# EasyEDA Pro project 3020包裹款控制板V1.1.eprj, board PCB
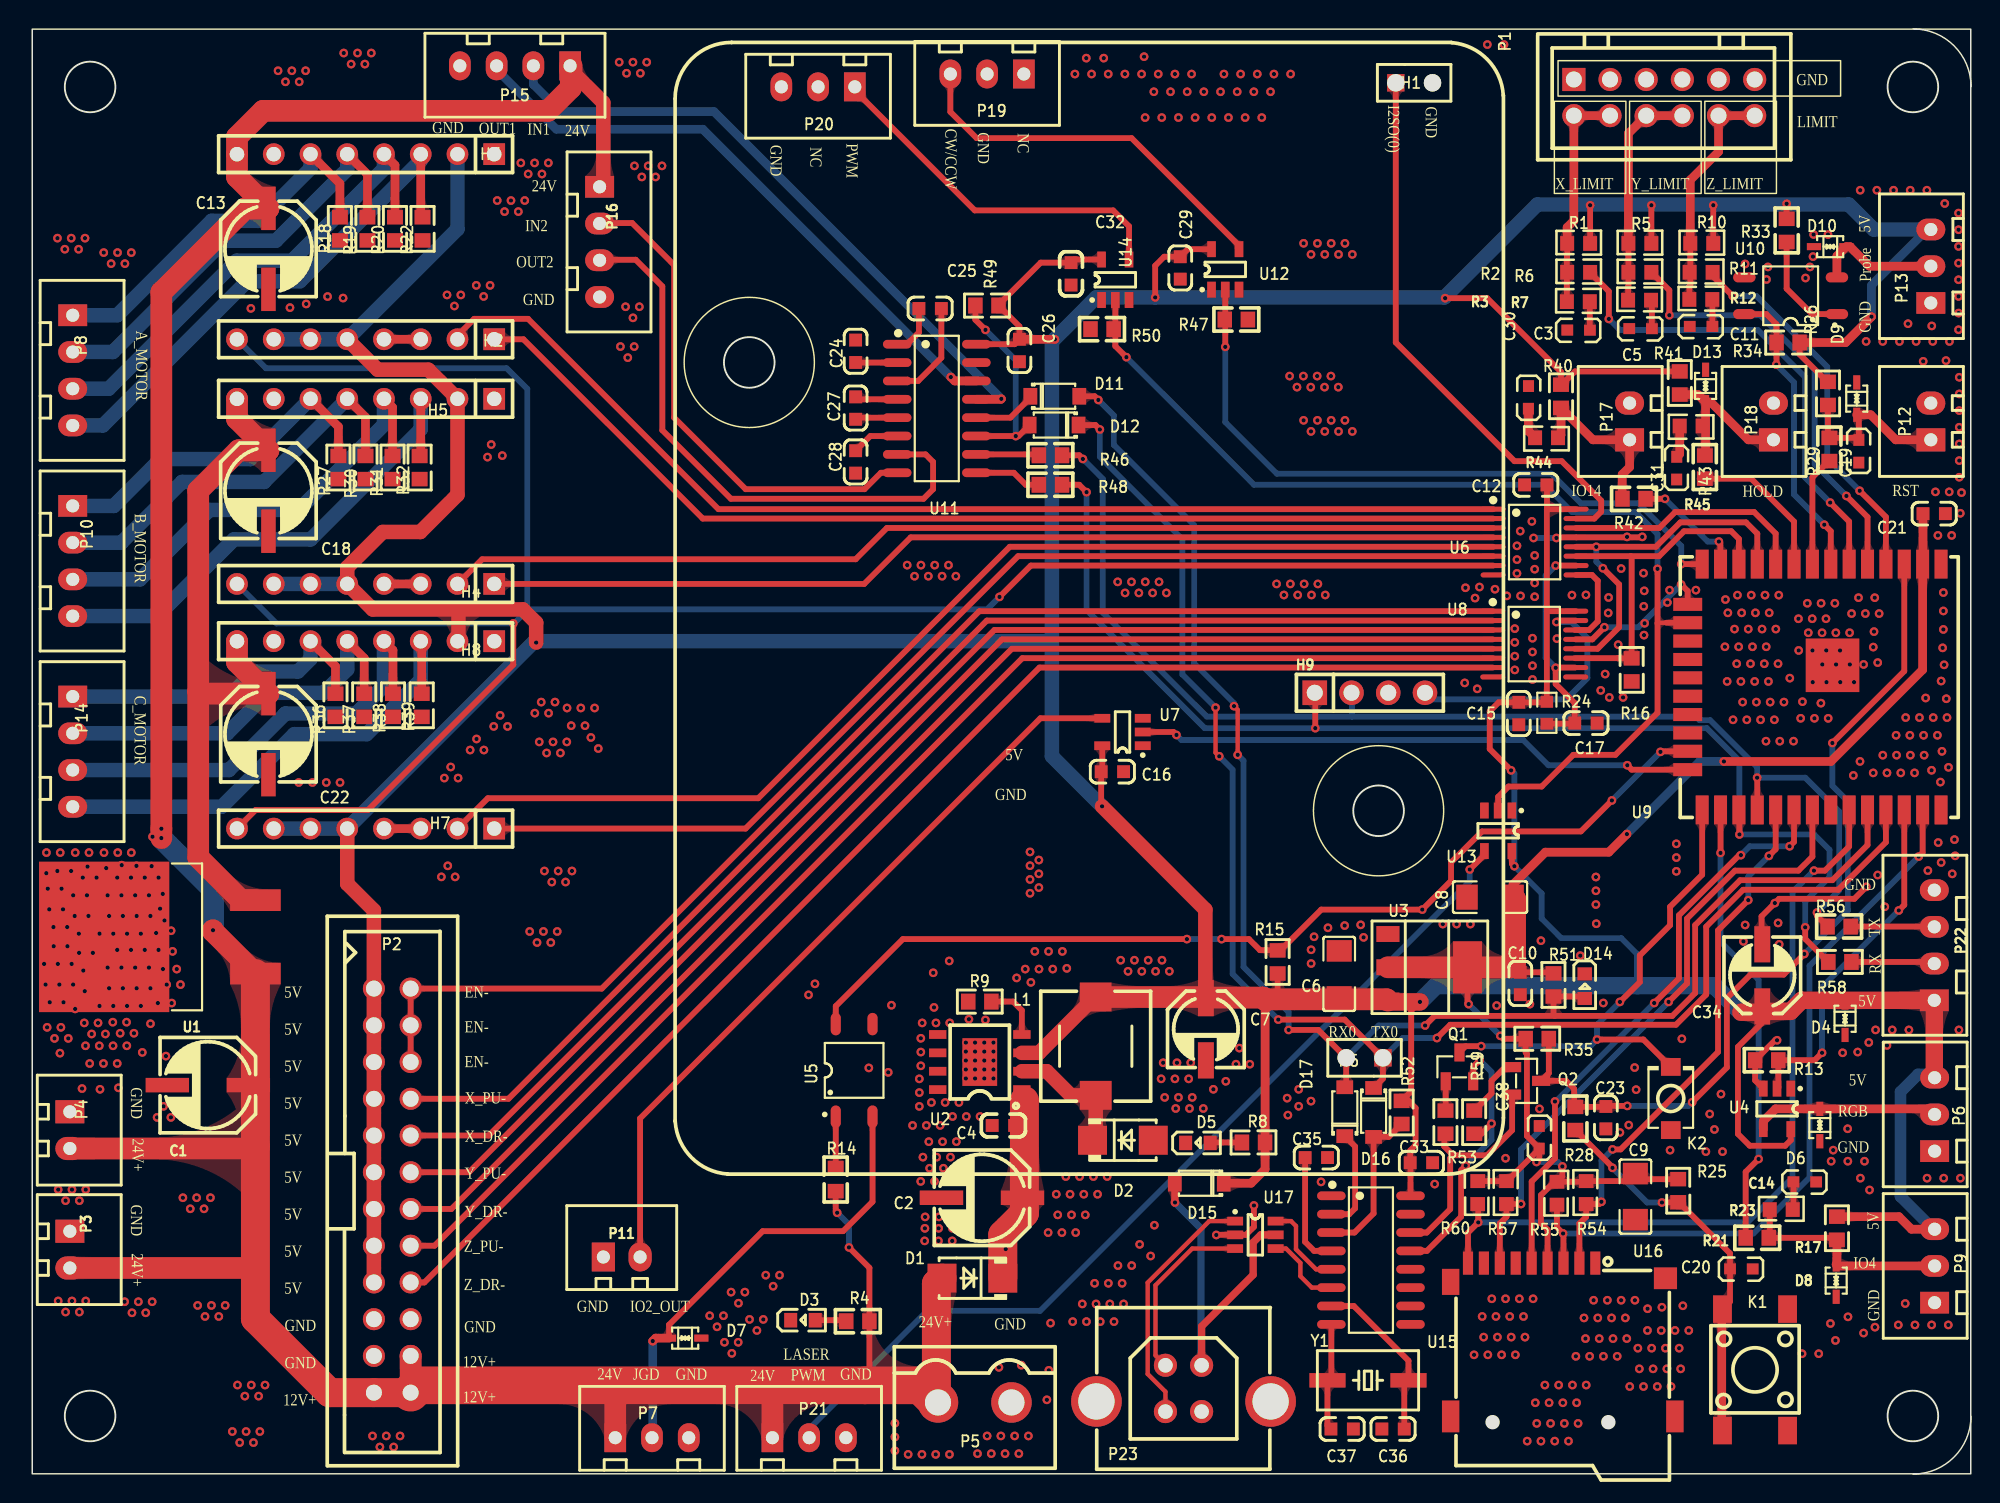
[diagram p1: board, top side]
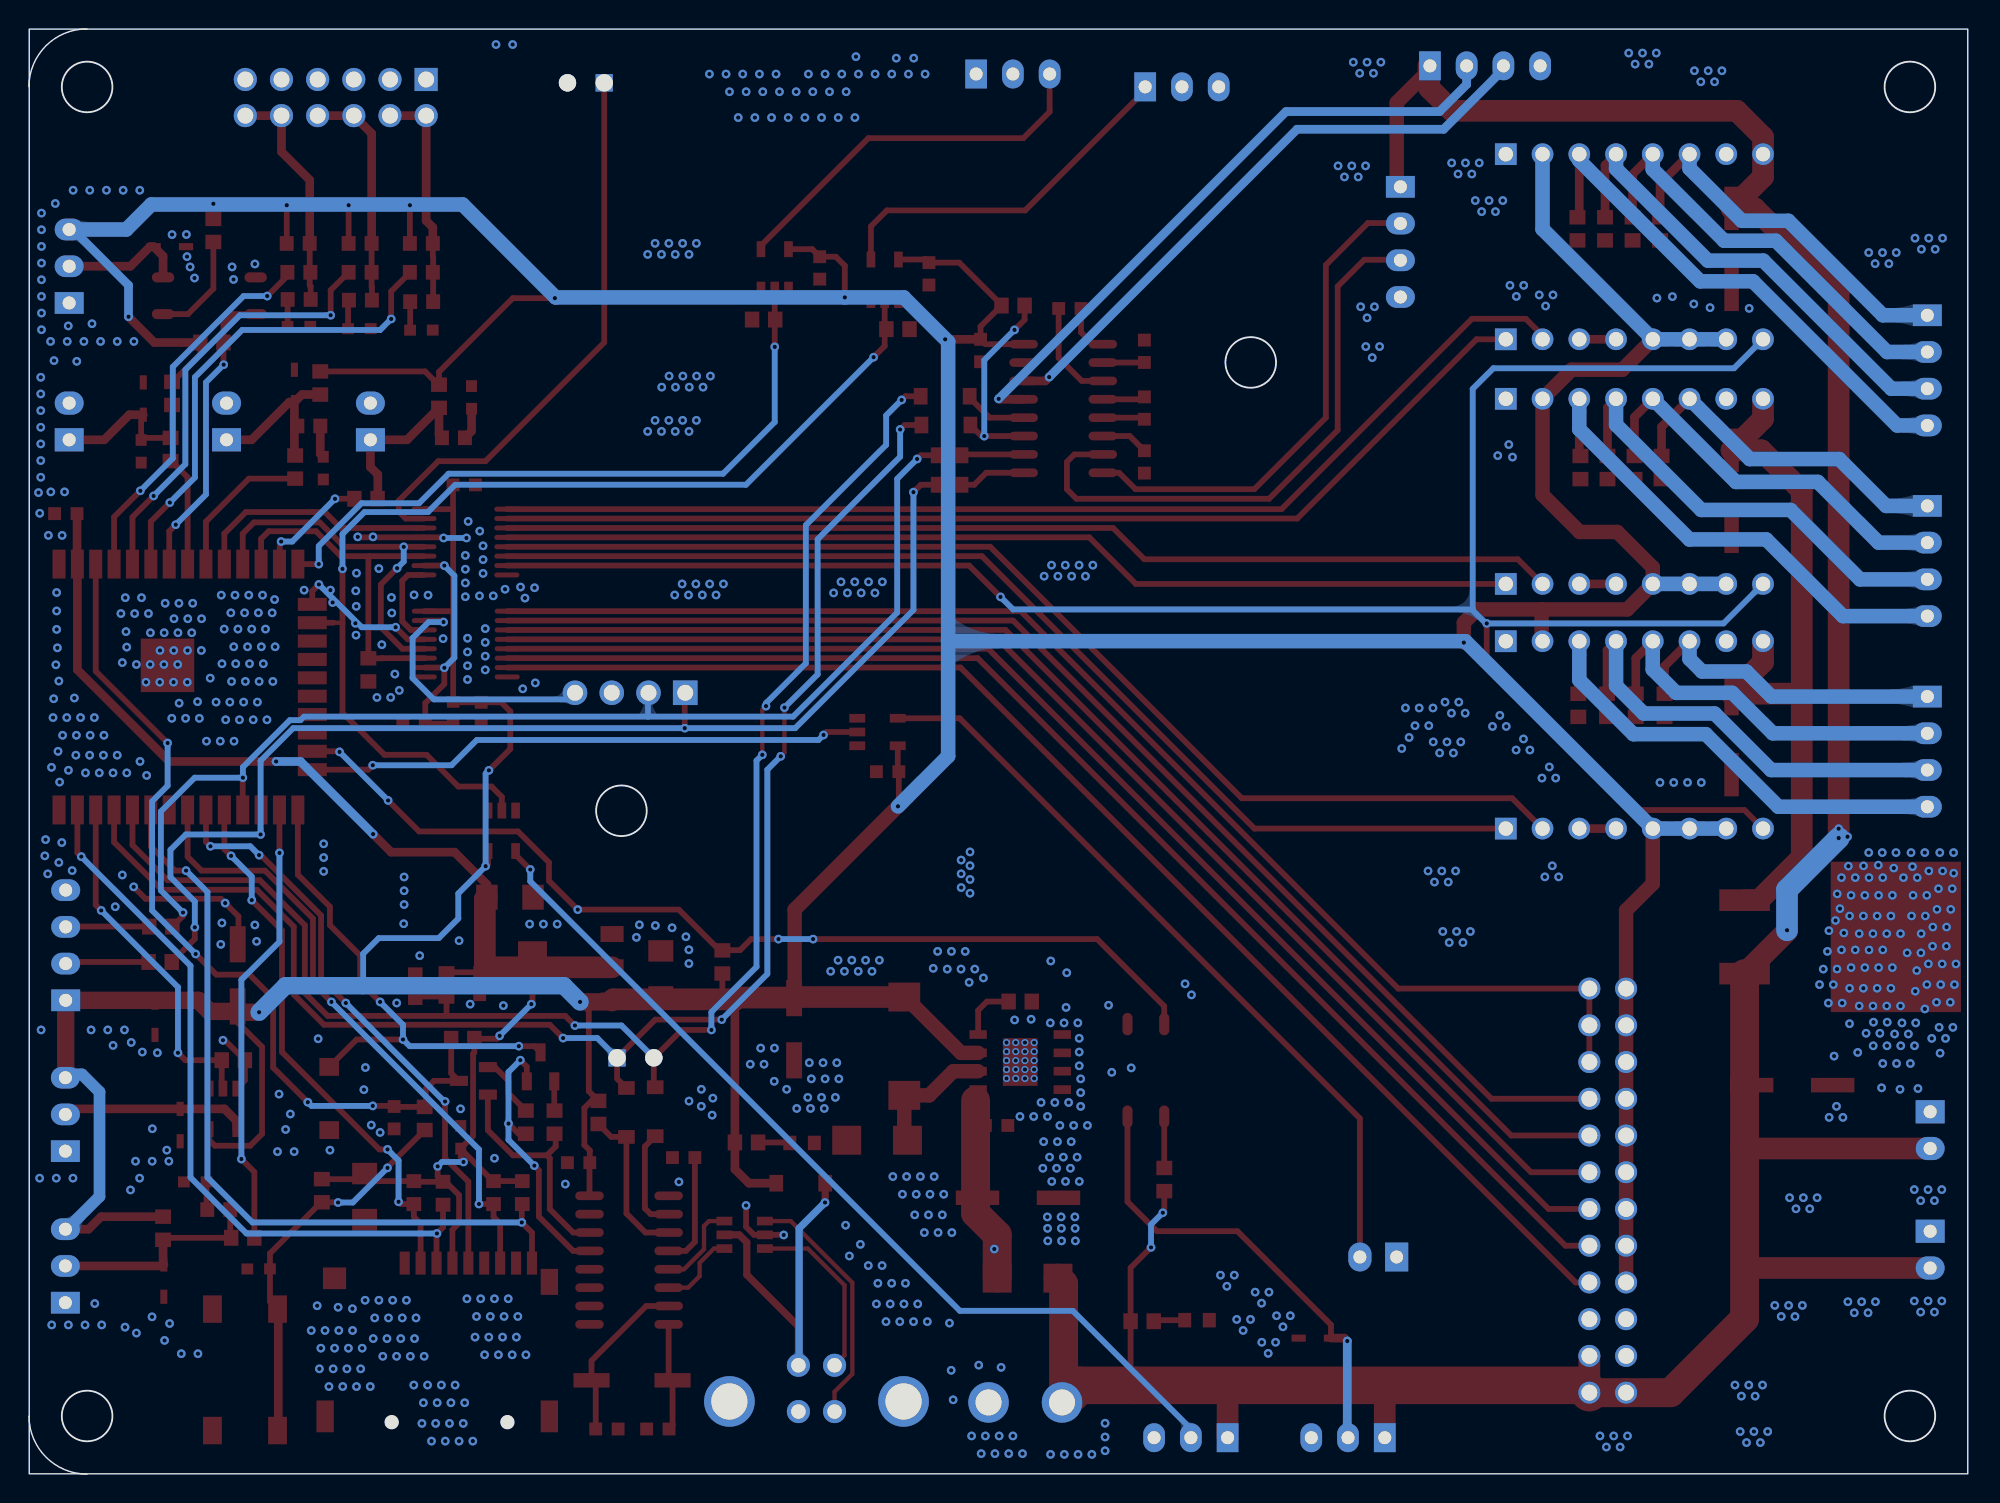
[diagram p2: board, bottom side, seen from below]

Outline 134.02 x 99.93 mm; copper layers: Top Layer, Bottom Layer. Coordinates in mm from the lower left corner of the outline.
Outline path: rectangle 0,99.92 134,0.02 ; circle c4,95.92 r1.75 ; circle c4,4.02 r1.75 ; circle c49.56,76.87 r1.75 ; circle c93.06,45.87 r1.75 ; circle c130,95.92 r1.75 ; circle c130,4.02 r1.75 ; 130.02,99.93 arc(132.85,98.76) 134.02,95.93 ; 134.01,4 arc(132.84,1.17) 130.01,0
Stack: Top Layer 0.035mm / Dielectric1 1.51mm FR4 er 4.5 / Bottom Layer 0.035mm

## Design rules (mm)
template: 用户自定义配置
spacing Default (default): track to track 0.152, other pairs 0 to 0.152
track width Default (default): min 0.254, default 0.254, max 25.4
differential pair differentialPair (default): width min 0.127, default 0.254, max 2.54; gap min 0.152, default 0.152
via Default (default): diameter min 0.25, default 0.61, max 100.025; hole min 0.2, default 0.305, max 59.995

## Placement (name value [footprint] x y rotation side)
C1  100uF/35V  [电解电容贴片6X6]  12.14 26.89 180 top
C2  100uF/35V  [电解电容贴片6X6]  65.65 19.11 180 top
C3  103  [11]  107.63 78.8 0 top
C4  104  [0603C]  67.13 24.1 0 top
C5  103  [11]  111.92 78.9 0 top
C6  10uF  [C1206]  90.34 34.58 90 top
C7  100uF/10V  [CAP-SMD_BD5.0-L5.3-W5.3-RD]  81.13 30.76 90 top
C8  4.7uF  [C1206]  100.77 39.89 0 top
C9  4.7uF  [C1206]  110.82 19.19 90 top
C10  104  [0603C]  102.86 33.92 90 top
C11  103  [11]  116.1 79.06 0 top
C12  104  [0603C]  103.93 68.4 180 top
C13  100uF/35V  [电解电容贴片6X6]  16.33 84.72 270 top
C14  103  [11]  123.27 19.91 0 top
C15  104  [0603C]  102.76 52.59 270 top
C16  104  [0603C]  74.66 48.57 180 top
C17  104  [0603C]  107.4 51.93 180 top
C18  100uF/35V  [电解电容贴片6X6]  16.33 67.99 270 top
C19  103  [11]  125.96 69.98 270 top
C20  103  [11]  118.88 13.89 0 top
C21  104  [0603C]  131.47 66.41 0 top
C22  100uF/35V(47uF/50V)  [电解电容贴片6X6]  16.33 51.16 270 top
C23  104  [0603C]  108.78 24.64 90 top
C24  104  [0603C]  56.92 77.64 270 top
C25  104  [0603C]  62.07 80.6 180 top
C26  104  [0603C]  68.24 77.69 90 top
C27  104  [0603C]  56.92 73.71 90 top
C28  104  [0603C]  56.92 69.99 270 top
C29  104  [0603C]  79.36 83.4 90 top
C30  103  [11]  103.72 75.19 90 top
C31  103  [11]  113.37 68.82 270 top
C32  104  [0603C]  71.81 82.99 90 top
C33  104  [0603C]  96.03 21.53 0 top
C34  100uF/10V  [CAP-SMD_BD5.0-L5.3-W5.3-RD]  119.59 34.49 270 top
C35  104  [0603C]  88.76 21.89 0 top
C36  18pF  [0603C]  94.07 3.12 180 top
C37  18pF  [0603C]  90.55 3.12 0 top
C38  104  [11]  104.47 24.03 90 top
D1  SS56  [SMA]  64.99 13.55 180 top
D2  SS34  [SMA]  75.39 23.08 0 top
D3  绿光  [0603LED]  53.24 10.62 180 top
D4  PESD5V0L1BA-N  [SOD-323_L1.8-W1.3-LS2.5-BI]  125.31 31.48 90 top
D5  绿光  [0603LED]  80.54 22.88 180 top
D6  PESD5V0L1BA-N  [SOD-323_L1.8-W1.3-LS2.5-BI]  123.57 24.13 90 top
D7  PESD5V0L1BA-N  [SOD-323_L1.8-W1.3-LS2.5-BI]  45.14 9.4 180 top
D8  PESD5V0L1BA-N  [SOD-323_L1.8-W1.3-LS2.5-BI]  124.7 13.38 90 top
D9  PESD5V0L1BA-N  [SOD-323_L1.8-W1.3-LS2.5-BI]  126.12 74.37 270 top
D10  PESD5V0L1BA-N  [SOD-323_L1.8-W1.3-LS2.5-BI]  124.28 84.87 0 top
D11  1N4148  [SOD-123_L2.8-W1.8-LS3.7-RD]  70.69 74.53 0 top
D12  1N4148  [SOD-123_L2.8-W1.8-LS3.7-RD]  70.64 72.54 180 top
D13  PESD5V0L1BA-N  [SOD-323_L1.8-W1.3-LS2.5-BI]  115.67 75.24 270 top
D14  绿光  [0603LED]  107.3 33.77 90 top
D15  1N4148  [SOD-123_L2.8-W1.8-LS3.7-RD]  80.67 20.11 180 top
D16  1N4148  [SOD-123_L2.8-W1.8-LS3.7-RD]  92.72 25.01 270 top
D17  1N4148  [SOD-123_L2.8-W1.8-LS3.7-RD]  90.73 25.06 90 top
H1  PZ254  [HDR-TH_2P-P2.54-V-M]  95.52 96.2 0 top
H2  PZ254V-11-08P  [HDR-TH_8P-P2.54-V-M]  23.04 78.47 180 top
H3  PZ254V-11-08P  [HDR-TH_8P-P2.54-V-M]  23.04 91.27 180 top
H4  PZ254V-11-08P  [HDR-TH_8P-P2.54-V-M]  23.04 61.55 180 top
H5  PZ254V-11-08P  [HDR-TH_8P-P2.54-V-M]  23.04 74.35 180 top
H6  PZ254V-11-02P  [HDR-TH_2P-P2.54-V-M]  92.1 28.78 180 top
H7  PZ254V-11-08P  [HDR-TH_8P-P2.54-V-M]  23.04 44.64 180 top
H8  PZ254V-11-08P  [HDR-TH_8P-P2.54-V-M]  23.04 57.59 180 top
H9  PZ254V-11-04P  [HDR-TH_4P-P2.54-V-M]  92.46 54.03 0 top
K1  SW_6X6_H=12.0MM  [KEY-SMD_4P-L6.0-W6.0-P4.50-LS9.0]  119.09 7.21 270 top
K2  TS-1088  [SW-SMD_L3.9-W3.0-P4.45]  113.26 25.97 90 top
L1  68uH  [IND-SMD_L7.0-W7.0_SMDRI74-330MT]  73.51 29.59 270 top
P1  XHD2.54-2x6A  [CONN-TH_12P-P2.50_HC-XHD2.54-2X6A]  112.81 95.18 180 top
P2  XHD2.54-2*12  [IDC-TH_24P-P2.54-V-R2-C12-S2.54]  24.89 19.6 270 top
P3  2P  [HDR1X2_CON]  2.6 15.52 270 top
P4  2P  [HDR1X2_CON]  2.6 23.78 270 top
P5  KF2EDGVC-5.08-2P  [CONN-TH_P5.08_KF2EDGVC-5.08-2P]  65.15 4.95 0 top
P6  3P  [HDR1X3_CON]  131.5 24.87 90 top
P7  3P  [HDR1X3_CON]  42.84 2.52 0 top
P8  4P  [HDR1X4_CON]  2.8 80.13 270 top
P9  3P  [HDR1X3_CON]  131.5 14.39 90 top
P10  4P  [HDR1X4_CON]  2.8 66.95 270 top
P11  2P  [HDR1X2_CON]  40.75 15.01 0 top
P12  2P  [HDR1X2_CON]  131.24 72.79 90 top
P13  3P  [HDR1X3_CON]  131.24 83.52 90 top
P14  4P  [HDR1X4_CON]  2.8 53.76 270 top
P15  4P  [HDR1X4_CON]  37.18 97.38 180 top
P16  4P  [HDR1X4_CON]  39.22 89.01 270 top
P17  2P  [HDR1X2_CON]  110.42 72.79 90 top
P18  2P  [HDR1X2_CON]  120.36 72.79 90 top
P19  3P  [HDR1X3_CON]  66 96.81 180 top
P20  3P  [HDR1X3_CON]  54.32 95.92 180 top
P21  3P  [HDR1X3_CON]  53.7 2.52 0 top
P22  4P  [HDR1X4_CON]  131.48 32.76 90 top
P23  USB-B12-BRW  [USB-B-TH_USB-B12-BRW]  79.58 5.92 0 top
Q1  SS8050  [SOT-23-3_L2.9-W1.3-P1.90-LS2.4-BR]  98.66 28.16 270 top
Q2  SS8050  [SOT-23-3_L2.9-W1.3-P1.90-LS2.4-BR]  103.3 27.19 180 top
R1  51K  [10]  106 84.98 0 top
R2  100  [10]  106 82.98 0 top
R3  100  [10]  105.98 80.95 0 top
R4  47K  [0603R]  57.07 10.57 0 top
R5  51K  [10]  110.23 84.98 0 top
R6  100  [10]  110.23 82.98 0 top
R7  100  [10]  110.21 81.06 0 top
R8  10K  [0603R]  84.42 22.93 0 top
R9  10K  [0603R]  65.5 32.67 180 top
R10  51K  [10]  114.51 84.98 0 top
R11  100  [10]  114.47 82.98 0 top
R12  100  [10]  114.45 81.11 0 top
R13  10K  [0603R]  119.9 28.62 180 top
R14  22K  [0603R]  55.54 20.37 90 top
R15  10K  [0603R]  86.09 35.41 90 top
R16  10K  [0603R]  110.56 55.61 270 top
R17  10K  [0603R]  124.75 17 270 top
R18  10K  [0603R]  21.27 86.11 270 top
R19  10K  [0603R]  23.17 86.11 270 top
R20  10K  [0603R]  25.08 86.11 270 top
R21  100  [0603R]  119.24 16.34 0 top
R22  10K  [0603R]  26.98 86.11 270 top
R23  100  [10]  120 18.17 0 top
R24  10kΩ  [R0603]  104.7 52.64 90 top
R25  10K  [0603R]  113.77 19.59 270 top
R26  10K  [0603R]  124.13 74.73 270 top
R27  10K  [0603R]  21.17 69.6 270 top
R28  100  [0603R]  106.66 24.59 270 top
R29  100  [0603R]  124.23 70.85 90 top
R30  10K  [0603R]  23.04 69.6 270 top
R31  10K  [0603R]  24.91 69.6 270 top
R32  10K  [0603R]  26.78 69.6 270 top
R33  1K  [0603R]  121.27 86 270 top
R34  10K  [0603R]  121.37 78.24 180 top
R35  10K  [0603R]  104.03 30.1 0 top
R36  10K  [0603R]  20.96 53.16 270 top
R37  10K  [0603R]  22.95 53.16 270 top
R38  10K  [0603R]  24.94 53.16 270 top
R39  10K  [0603R]  26.92 53.16 270 top
R40  10K  [0603R]  105.67 74.53 270 top
R41  10K  [0603R]  113.88 75.45 270 top
R42  100  [0603R]  110.72 67.44 180 top
R43  100  [0603R]  115.62 69.63 90 top
R44  100  [10]  105.57 71.77 180 top
R45  100  [10]  115.57 72.59 180 top
R46  0Ω  [0603R]  70.38 70.45 0 top
R47  100  [0603R]  83.23 79.83 0 top
R48  0Ω  [0603R]  70.38 68.41 0 top
R49  10K  [0603R]  66 80.8 180 top
R50  10K  [0603R]  73.95 79.17 180 top
R51  10K  [0603R]  105.16 33.82 90 top
R52  10K  [0603R]  94.66 25.01 270 top
R53  10K  [0603R]  97.69 24.33 90 top
R54  10K  [10]  107.53 18.57 90 top
R55  10K  [10]  105.51 18.52 90 top
R56  100Ω  [0603R]  124.9 37.86 0 top
R57  10K  [10]  102.02 18.57 90 top
R58  100Ω  [0603R]  124.95 35.41 0 top
R59  10K  [0603R]  99.68 24.33 90 top
R60  10K  [10]  100.03 18.57 90 top
U1  CJ7812  [TO-263-2_L10.1-W9.1-P5.08-LS15.2-TL]  10.2 37.15 180 top
U2  XL1509-5.0E1//SXL1509-5.0E1  [ESOP-8_L4.9-W3.9-P1.27-LS6.0-BL-EP]  65.5 28.49 90 top
U3  1117-3.3  [SOT-223]  96.41 35.04 270 top
U4  74LVC1G17  [SOT-23-5]  120.61 25.25 270 top
U5  LTV-357T-C  [SOP-4_L4.4-W3.9-P2.54-LS7.0-TL]  56.81 27.91 90 top
U6  74AHCT595T16-13  [TSSOP-16_L5.0-W4.4-P0.65-LS6.4-BL]  103.85 64.45 270 top
U7  74LVC1G17  [SOT-23-5]  75.37 51.31 180 top
U8  74AHCT595T16-13  [TSSOP-16_L5.0-W4.4-P0.65-LS6.4-BL]  103.83 57.39 270 top
U9  ESP32-WROOM-32  [WIFI-SMD_ESP32-WROOM-32UE-A]  123.19 54.42 270 top
U10  LTV-357T-C  [SOP-4_L4.4-W3.9-P2.54-LS7.0-TL]  121.55 81.48 180 top
U11  SP3232EEN-L/TR  [SOIC-16_L9.9-W3.9-P1.27-LS6.0-BL]  62.53 73.68 270 top
U12  74LVC1G17  [SOT-23-5]  82.47 83.3 90 top
U13  74LVC1G17  [SOT-23-5]  101.33 44.48 270 top
U14  74LVC1G17  [SOT-23-5]  74.87 82.58 90 top
U15  CH340G  [SOIC-16_L9.9-W3.9-P1.27-LS6.0-BL]  92.54 14.8 270 top
U16  自弹TF卡座TFAA  [SIM-SMD_C9900015645]  105.8 9.29 0 top
U17  USBLC2-2SC6  [SOT-23-6]  84.55 16.54 0 top
Y1  12M  [晶振贴片49SSMD]  92.33 6.48 0 top

## Footprints (pads in the part's own frame, mm; a bottom-side part is the same pattern mirrored in y, then rotated)
10
  rect 0.965x1.016 smd: 1(0.101,0.117) 2(1.688,0.117)
11
  rect 0.813x0.762 smd: 1(0.043,0.296) 2(-1.524,0.301)
0603C
  rect 0.889x0.889 smd: 1(-0.774,0) 2(0.774,0)
0603LED
  rect 0.9x1 smd: 1(-0.884,-0.017) 2(0.816,-0.017)
0603R
  rect 1x1.1 smd: 1(-0.8,0) 2(0.8,0)
C1206
  rect 1.485x1.728 smd: 1(-1.593,0) 2(1.593,0)
CAP-SMD_BD5.0-L5.3-W5.3-RD
  rect 2.5x1.1 smd: 1(2.15,0) 2(-2.15,0)
CONN-TH_12P-P2.50_HC-XHD2.54-2X6A
  rect 1.6x1.6 hole 1.1: 1(6.25,-1.25)
  round 1.6 hole 1.1: 2(6.25,1.25) 3(3.75,-1.25) 4(3.75,1.25) 5(1.25,-1.25) 6(1.25,1.25) 7(-1.25,-1.25) 8(-1.25,1.25) 9(-3.75,-1.25) 10(-3.75,1.25) 11(-6.25,-1.25) 12(-6.25,1.25)
CONN-TH_P5.08_KF2EDGVC-5.08-2P
  round 2.8 hole 1.8: 1(-2.54,0) 2(2.54,0)
ESOP-8_L4.9-W3.9-P1.27-LS6.0-BL-EP
  rect 0.6x1.2 smd: 1(-1.905,-2.909) 2(-0.635,-2.909) 3(0.635,-2.909) 4(1.905,-2.909) 5(1.905,2.909) 6(0.635,2.909) 7(-0.635,2.909) 8(-1.905,2.909)
  rect 3.3x2.4 smd: 9(0,0)
HDR1X2_CON
  rect 1.6x2 hole 0.9: 1(-1.27,0)
  oval 1.6x2 hole 0.9: 2(1.27,0)
HDR1X3_CON
  rect 1.5x2 hole 0.9: 1(-2.54,0)
  oval 1.5x2 hole 0.9: 2(0,0) 3(2.54,0)
HDR1X4_CON
  rect 1.5x2 hole 0.9: 1(0,0)
  oval 1.5x2 hole 0.9: 2(2.54,0) 3(5.08,0) 4(7.62,0)
HDR-TH_2P-P2.54-V-M
  rect 1.2x1.2 hole 1.2x0.8: 1(-1.27,0)
  round 1.2 hole 1.2x0.8: 2(1.27,0)
HDR-TH_4P-P2.54-V-M
  rect 1.7x1.7 hole 1.1: 1(-3.81,0)
  round 1.7 hole 1.1: 2(-1.27,0) 3(1.27,0) 4(3.81,0)
HDR-TH_8P-P2.54-V-M
  rect 1.5x1.5 hole 1: 1(-8.89,0)
  round 1.5 hole 1: 2(-6.35,0) 3(-3.81,0) 4(-1.27,0) 5(1.27,0) 6(3.81,0) 7(6.35,0) 8(8.89,0)
IDC-TH_24P-P2.54-V-R2-C12-S2.54
  round 1.524 hole 1.1: 1(-13.97,-1.27) 2(-13.97,1.27) 3(-11.43,-1.27) 4(-11.43,1.27) 5(-8.89,-1.27) 6(-8.89,1.27) 7(-6.35,-1.27) 8(-6.35,1.27) 9(-3.81,-1.27) 10(-3.81,1.27) 11(-1.27,-1.27) 12(-1.27,1.27) 13(1.27,-1.27) 14(1.27,1.27) 15(3.81,-1.27) 16(3.81,1.27) 17(6.35,-1.27) 18(6.35,1.27) 19(8.89,-1.27) 20(8.89,1.27) 21(11.43,-1.27) 22(11.43,1.27) 23(13.97,-1.27) 24(13.97,1.27)
IND-SMD_L7.0-W7.0_SMDRI74-330MT
  rect 2x2.2 smd: 1(-3.4,0) 2(3.4,0)
KEY-SMD_4P-L6.0-W6.0-P4.50-LS9.0
  rect 1.9x1.3 smd: 1(-4.2,2.25) 2(4.2,2.25) 3(-4.2,-2.25) 4(4.2,-2.25)
R0603
  rect 0.806x0.864 smd: 1(-0.753,0) 2(0.753,0)
SIM-SMD_C9900015645
  rect 0.7x1.6 smd: 1(2.25,5.3) 2(1.15,5.3) 3(0.05,5.3) 4(-1.05,5.3) 5(-2.15,5.3) 6(-3.25,5.3) 7(-4.35,5.3) 8(-5.45,5.3) 9(-6.55,5.3)
  rect 1.2x1.8 smd: 10(-7.75,4)
  rect 1.6x1.5 smd: 11(7.1,4.25)
  rect 1.2x2.2 smd: 12(-7.75,-5.3) 13(7.75,-5.3)
SMA
  rect 2x2 smd: 1(2.1,0) 2(-2.1,0)
SOD-123_L2.8-W1.8-LS3.7-RD
  rect 0.95x1.15 smd: 1(-1.692,0) 2(1.692,0)
SOD-323_L1.8-W1.3-LS2.5-BI
  rect 0.986x0.49 smd: 1(-1.117,0) 2(1.117,0)
SOIC-16_L9.9-W3.9-P1.27-LS6.0-BL
  oval 0.602x1.971 smd: 1(-4.445,-2.736) 2(-3.175,-2.736) 3(-1.905,-2.736) 4(-0.635,-2.736) 5(0.635,-2.736) 6(1.905,-2.736) 7(3.175,-2.736) 8(4.445,-2.736) 9(4.445,2.736) 10(3.175,2.736) 11(1.905,2.736) 12(0.635,2.736) 13(-0.635,2.736) 14(-1.905,2.736) 15(-3.175,2.736) 16(-4.445,2.736)
SOP-4_L4.4-W3.9-P2.54-LS7.0-TL
  oval 1.55x0.7 smd: 1(-3.2,1.27) 2(-3.2,-1.27) 3(3.2,-1.27) 4(3.2,1.27)
SOT-23-3_L2.9-W1.3-P1.90-LS2.4-BR
  rect 1.25x0.7 smd: 1(1,-0.95) 2(1,0.95) 3(-1,0)
SOT-23-5
  rect 1.1x0.6 smd: 1(-1.4,0.95) 2(-1.4,0) 3(-1.4,-0.95) 4(1.4,-0.95) 5(1.4,0.95)
SOT-23-6
  rect 1.1x0.6 smd: 1(-1.4,0.95) 2(-1.4,0) 3(-1.4,-0.95) 4(1.4,-0.95) 5(1.4,0) 6(1.4,0.95)
SOT-223
  rect 1.1x1.6 smd: 1(-2.3,-2.7) 2(0,-2.7) 3(2.3,-2.7)
  rect 3.6x2 smd: 4(0,2.8)
SW-SMD_L3.9-W3.0-P4.45
  rect 1.23x1.36 smd: 1(-2.185,0) 2(2.185,0)
TO-263-2_L10.1-W9.1-P5.08-LS15.2-TL
  rect 3.5x1.5 smd: 1(-5.228,2.54) 3(-5.228,-2.54)
  rect 9x10.4 smd: 2(5.228,0)
TSSOP-16_L5.0-W4.4-P0.65-LS6.4-BL
  oval 0.343x1.732 smd: 1(-2.275,-2.866) 2(-1.625,-2.866) 3(-0.975,-2.866) 4(-0.325,-2.866) 5(0.325,-2.866) 6(0.975,-2.866) 7(1.625,-2.866) 8(2.275,-2.866) 9(2.275,2.866) 10(1.625,2.866) 11(0.975,2.866) 12(0.325,2.866) 13(-0.325,2.866) 14(-0.975,2.866) 15(-1.625,2.866) 16(-2.275,2.866)
USB-B-TH_USB-B12-BRW
  round 1.6 hole 1: 1(1.25,1.6) 2(-1.25,1.6) 3(-1.25,-1.6) 4(1.25,-1.6)
  round 3.5 hole 2.5: 5(-6.02,-0.9) 6(6.02,-0.9)
WIFI-SMD_ESP32-WROOM-32UE-A
  rect 2x0.9 smd: 1(-8.5,8.755) 2(-8.5,7.485) 3(-8.5,6.215) 4(-8.5,4.945) 5(-8.5,3.675) 6(-8.5,2.405) 7(-8.5,1.135) 8(-8.5,-0.135) 9(-8.5,-1.405) 10(-8.5,-2.675) 11(-8.5,-3.945) 12(-8.5,-5.215) 13(-8.5,-6.485) 14(-8.5,-7.755) 25(8.5,-7.755) 26(8.5,-6.485) 27(8.5,-5.215) 28(8.5,-3.945) 29(8.5,-2.675) 30(8.5,-1.405) 31(8.5,-0.135) 32(8.5,1.135) 33(8.5,2.405) 34(8.5,3.675) 35(8.5,4.945) 36(8.5,6.215) 37(8.5,7.485) 38(8.5,8.755)
  rect 0.9x2 smd: 15(-5.715,-8.755) 16(-4.445,-8.755) 17(-3.175,-8.755) 18(-1.905,-8.755) 19(-0.635,-8.755) 20(0.635,-8.755) 21(1.905,-8.755) 22(3.175,-8.755) 23(4.445,-8.755) 24(5.715,-8.755)
  rect 3.7x3.7 smd: 39(-1.5,1.255)
晶振贴片49SSMD
  rect 2.5x1 smd: 1(-2.8,0) 2(2.8,0)
电解电容贴片6X6
  rect 3x1 smd: 1(-2.8,0) 2(2.8,0)

## Nets
As in the schematic.

Pads without a net: P19 1; P20 2; U2 9; U4 1; U7 1; U8 9; U9 17 18 19 20 21 22 32; U12 1; U13 1; U14 1; U15 9 10 11 12 15; U16 1 8

## Via types
v1: diameter 0.5, hole 0.3, Top Layer to Bottom Layer, 20 vias
v2: diameter 0.6, hole 0.3, Top Layer to Bottom Layer, 958 vias

## Routing (per net, layer and track width the routed paths; a pad name or vN(x,y) marks a point on that pad's centre or on a via; arc(x,y) is an arc through that point)
3V3: length 101.9
  Top Layer w0.4: v2(99.29,32.5) 99.21,32.57 U3.4 ; U16.4 104.75,16.89 104.29,17.35 104.29,19.29 105.21,20.21 R55.2 ; R55.2 107.37,20.21 R54.2 110.3,20.26 C9.2 111.2,20.39 113.77,20.39 ; R55.2 105.77,20.58 v2(105.77,21.28) ; 102.86,34.7 105.08,34.7 R51.2 ; 104.17,22.48 101.95,20.26 R57.2 R60.2 ; 104.17,22.48 104.17,21.77 v2(103.98,21.58) ; 104.17,22.48 C38.2 104.17,22.53 103.32,23.38 103.32,29.06 103.23,29.15 R35.1 101.69,30.1 v2(101.48,30.3)
  Top Layer w0.6: 130.7,66.41 130.7,62.95 U9.2 130.67,55.62 124.33,49.28 v2(116.94,49.28) ; C8.2 102.36,40.77 104.59,43 108.98,43 v2(110.23,44.25)
  Top Layer w1.5: 102.18,35.03 102.5,35.35 102.5,39.75 C8.2 ; U3.2 U3.4 102.18,35.04
  Bottom Layer w0.4: v2(101.48,30.3) v2(99.29,32.5) ; v2(103.98,21.58) 105.46,21.58 v2(105.77,21.28)
  Bottom Layer w0.6: v2(116.94,49.28) 115.25,49.28 v2(110.23,44.25)
5V_VCC: length 537.9
  Top Layer w0.4: 104.7,59.64 104.7,53.4 104.67,53.37 101.37,53.37 100.75,52.74 100.75,50.14 v2(102.23,48.66) ; 104.7,59.64 104.7,66.72 104.71,66.73 ; 104.7,59.64 104.73,59.67 U8.16 ; R15.1 86.09,32.95 85.97,32.83 ; 111.92,85.1 v2(111.92,87.74) ; v2(102.45,42.03) 102.28,42.21 U13.5 ; R26.1 124.08,75.53 122.17,77.43 R34.1 ; v2(77.62,81.36) 77.62,83.56 78.24,84.18 C29.2 79.88,84.7 U12.5 ; R33.1 v2(121.27,87.84) ; 106.72,66.72 104.71,66.72 104.71,66.73 ; C12.1 104.71,66.73 ; R1.2 v2(107.69,87.74) ; R41.1 106.64,76.25 105.72,75.33 R40.1 105.67,76.21 100.57,81.31 v2(97.67,81.31) ; U7.5 73.97,48.64 C16.2 73.89,46.23 ; 119.54,31.99 119.54,31.17 117.91,29.54 117.91,23.52 118.72,22.7 121.17,22.7 121.56,23.09 U4.5 ; U11.16 67.9,78.13 C26.2 68.24,79.36 R49.1 66.79,80.85 69.71,83.77 C32.2 72.02,83.98 U14.5 ; v2(95.92,32.65) 95.32,32.05 95.32,26.47 R52.1 95.13,25.81 95.63,25.31 95.63,22.75 95.25,22.38 C33.1 95.27,21.51 U15.16 ; R10.2 v2(116.2,87.74)
  Top Layer w0.6: P9.3 129.9,16.93 129.03,17.8 R17.1 ; R34.1 125.35,78.24 v2(127.14,80.03) ; C26.2 v2(70.69,78.47) ; 85.22,32.68 R8.2 85.22,21.08 84.25,20.11 D15.1
  Top Layer w1: H7.5 21.77,40.82 23.62,38.98 P2.1 P2.3 P2.5 P2.7 P2.9 P2.11 P2.13 P2.15 P2.17 ; 29.46,59.79 29.46,57.66 H8.2 ; 29.46,59.79 33.92,59.79 34.83,58.87 v2(34.83,57.49) ; 29.46,59.79 23.54,59.79 H4.5 21.77,62.69 24.23,65.14 26.83,65.14 29.39,67.71 H5.2 27.38,76.36 23.88,76.36 H2.5 ; U2.3 69.59,29.13 73.45,32.99 ; 81.09,33.02 81.09,39.03 v2(73.95,46.17) ; 81.13,32.99 C7.1
  Top Layer w1.2: v2(118.11,31.94) 119.48,31.94 119.54,31.99 121.54,31.99 122.31,32.76 P22.1 131.48,27.43 P6.3 ; 93.81,32.65 v2(95.92,32.65)
  Top Layer w1.5: U3.3 93.63,32.83 85.36,32.83 85.28,32.74 85.07,32.95 81.27,32.95 81.23,32.99 L1.1
  Bottom Layer w0.4: 110.98,33.77 110.92,33.83 110.92,35.98 109.84,37.06 105.69,37.06 104.34,38.41 104.34,40.15 v2(102.45,42.03) 102.45,48.43 v2(102.23,48.66)
  Bottom Layer w0.6: 130.99,86.06 127.14,82.21 v2(127.14,80.03)
  Bottom Layer w0.8: 131.5,17.08 131.25,17.08 129.14,19.19 129.14,26.43 130.35,27.64 131.5,27.64
  Bottom Layer w1: 70.48,57.64 70.44,57.6 34.74,57.6 H7.5 H7.6 H7.7 ; 70.48,57.64 70.48,49.64 v2(73.95,46.17) ; 70.48,57.64 70.48,78.3 73.54,81.36 v2(77.62,81.36) 97.62,81.36 104.04,87.79 125.56,87.79 127.29,86.06 P13.3 ; H3.2 29.39,86.09 H2.5 H2.6 H2.7 ; H4.5 H4.6 H4.7
  Bottom Layer w1.2: v2(118.11,31.94) 116.27,33.77 97.05,33.77 v2(95.92,32.65)
12V: length 232.1
  Top Layer w0.4: R14.1 55.54,18.17 v2(55.64,18.07) ; 57.57,6.14 57.87,6.43 R4.2 57.87,14.26 v2(56.46,15.67)
  Top Layer w1: 37.18,97.13 39.47,94.83 39.47,89.05
  Top Layer w1.5: P7.1 40.3,5.67 40.14,5.83 ; P21.1 51.16,5.67 51.1,5.73 ; P4.2 15.26,22.51 15.43,22.68 ; 15.05,14.14 14.94,14.25 P3.2 ; 37.23,97.08 37.23,95.85 35.65,94.27 15.96,94.27 14.15,92.46 H3.8 14.15,89.7 C13.1 14.73,87.52 8.92,81.72 v2(8.92,44.63) v2(8.92,43.98) ; v2(12.5,37.6) 12.5,37.54 U1.1 ; P2.22 P2.24
  Top Layer w1.6: 37.23,97.08 37.23,97.38
  Top Layer w2: D1.1 62.5,13.16 62.5,5.06 ; P2.24 P2.23 20.55,5.63 15.43,10.75 U1.1
  Top Layer w2.6: P2.24 26.66,6.14 61.43,6.14 62.5,5.06 P5.1
  Bottom Layer w0.4: v2(56.46,15.67) 56.46,17.25 v2(55.64,18.07)
  Bottom Layer w1.5: v2(8.92,43.98) 12.5,40.41 v2(12.5,37.6)
  vias: v2(8.31,44.07)
12V-SW: length 32.3
  Top Layer w0.4: D7.2 44.02,10.32 50.49,16.8 56.05,16.8 58.08,18.83 58.08,24.71
  Top Layer w0.6: v2(42.89,9.2) 43.1,9.4 D7.2
  Bottom Layer w0.6: v2(42.89,9.2) 42.89,2.57 P7.2
12V_DIV: length 50.5
  Top Layer w1.5: 11.47,54.12 11.47,42.64 14.43,39.69 U1.3 ; 11.47,54.12 11.63,53.96 C22.1 14.15,56.14 H8.8 ; 11.47,54.12 11.47,68 14.27,70.79 C18.1 14.15,72.97 H5.8
GND: length 36.6
  Top Layer w0.4: v2(113.98,61.52) 114.43,61.06 U9.15 ; v2(111.29,64.81) 111.26,64.77 105.4,64.77 v2(105.36,64.73) ; v2(120.61,30) 120.47,30 R13.2 119.09,27.22 U4.3 ; v2(81.85,16.53) 81.86,16.54 U17.2 83.9,16.54 84.45,17.09 v2(84.45,18.57) ; U8.13 107.84,57.72 v2(108.67,58.56) ; v2(126.78,40.61) 125.95,39.78 120.75,39.78 v2(120.46,39.48) 119.54,38.57 119.54,36.69 C34.2
  Bottom Layer w0.4: v2(113.98,61.52) 111.02,58.56 v2(108.67,58.56) ; v2(105.36,64.73) v2(103.78,64.73)
  vias: v2(0.82,35.28) v2(0.98,42.97) v2(0.97,41.55) v2(0.92,33.85) v2(1.08,40.48) v2(1.03,30.89) v2(1.18,39.05) v2(1.21,32.62) v2(1.47,37.83) v2(1.48,36.5) v2(1.54,30.13) v2(1.74,85.46) v2(1.74,41.7) v2(1.77,35.28) v2(1.8,19.67) v2(1.8,11.97) v2(1.87,33.85) v2(1.91,29.11) v2(1.94,42.97) v2(1.98,30.89) v2(2.03,40.48) v2(2.13,39.05) v2(2.16,32.62) v2(2.25,84.7) v2(2.3,18.91) v2(2.3,11.2) v2(2.42,37.83) v2(2.44,36.5) v2(2.49,30.13) v2(2.7,85.46) v2(2.69,41.7) v2(2.72,35.28) v2(2.75,19.67) v2(2.75,11.97) v2(2.83,40.02) v2(2.83,33.85) v2(2.97,42.97) v2(2.93,38.59) v2(2.97,32.17) v2(3.21,84.7) v2(3.22,37.37) v2(3.24,36.04) v2(3.26,18.91) v2(3.26,11.2) v2(3.5,41.24) v2(3.44,26.66) v2(3.53,34.82) v2(3.6,31.2) v2(3.65,85.46) v2(3.63,33.39) v2(3.68,29.62) v2(3.7,19.67) v2(3.7,11.97) v2(3.78,40.02) v2(3.82,42) v2(3.89,38.59) v2(3.92,42.97) v2(3.97,28.39) v2(4.11,30.43) v2(4.19,36.04) v2(4.45,41.24) v2(4.55,31.2) v2(4.65,37.37) v2(4.65,32.37) v2(4.63,29.62) v2(4.69,26.61) v2(4.94,84.46) v2(4.96,42.97) v2(4.92,28.39) v2(5.11,41.9) v2(5.06,30.43) v2(5.21,40.02) v2(5.21,35.02) v2(5.31,38.59) v2(5.31,33.59) v2(5.45,83.7) v2(5.6,37.37) v2(5.6,32.37) v2(5.57,31.25) v2(5.59,29.62) v2(5.9,84.46) v2(5.91,42.97) v2(5.88,41.24) v2(5.88,36.25) v2(5.88,28.39) v2(5.96,26.71) v2(6.08,30.48) v2(6.19,42.11) v2(6.16,40.02) v2(6.16,35.02) v2(6.27,38.59) v2(6.27,33.59) v2(6.41,83.7) v2(6.39,11.92) v2(6.55,37.37) v2(6.55,32.37) v2(6.52,31.25) v2(6.54,29.62) v2(6.85,84.46) v2(6.85,42.97) v2(6.83,41.24) v2(6.83,36.25) v2(6.89,11.15) v2(7.12,40.02) v2(7.12,35.02) v2(7.03,30.48) v2(7.2,42.06) v2(7.22,38.59) v2(7.22,33.59) v2(7.34,11.92) v2(7.51,37.37) v2(7.51,32.37) v2(7.61,29.16) v2(7.78,41.24) v2(7.78,36.25) v2(7.85,11.15) v2(8.07,40.02) v2(8.07,35.02) v2(8.17,38.59) v2(8.17,33.59) v2(8.17,31.14) v2(8.25,42.04) v2(8.29,11.92) v2(8.56,37.41) v2(8.68,32.57) v2(8.63,24.66) v2(8.73,41.24) v2(8.73,36.25) v2(8.84,39.1) v2(9.02,40.12) v2(9.04,34.92) v2(9.08,25.43) v2(9.14,38.28) v2(9.3,33.84) v2(9.24,28.9) v2(9.6,37.57) v2(9.58,24.66) v2(9.7,36.14) v2(9.64,32.57) v2(9.99,34.92) v2(10.25,33.84) v2(10.41,19.11) v2(10.92,18.34) v2(11.37,19.11) v2(11.43,11.66) v2(11.88,18.34) v2(11.94,10.9) v2(12.32,19.11) v2(12.39,11.66) v2(12.9,10.9) v2(13.34,11.66) v2(13.83,2.94) v2(14.19,6.16) v2(14.34,2.18) v2(14.7,5.39) v2(14.78,2.94) v2(15.11,80.61) v2(15.14,6.16) v2(15.29,2.18) v2(15.65,5.39) v2(15.73,2.94) v2(16.09,6.16) v2(16.99,97.04) v2(17.5,96.27) v2(17.82,80.66) v2(17.95,97.04) v2(18.46,96.27) v2(18.42,47.82) v2(18.9,97.04) v2(18.94,80.91) v2(19.37,47.82) v2(20.42,81.42) v2(20.33,47.82) v2(21.28,47.82) v2(21.49,81.32) v2(21.53,98.26) v2(22.04,97.5) v2(22.48,98.26) v2(22.99,97.5) v2(23.44,98.26) v2(23.52,2.64) v2(24.03,1.87) v2(24.47,2.64) v2(24.98,1.87) v2(25.43,2.64) v2(28.28,41.29) v2(28.49,48.13) v2(28.67,81.53) v2(28.72,42.06) v2(28.93,48.89) v2(29.18,80.77) v2(29.23,41.29) v2(29.44,48.13) v2(29.62,81.53) v2(30.27,50.07) v2(30.7,82.2) v2(30.71,50.83) v2(31.21,81.43) v2(31.22,50.07) v2(31.47,70.32) v2(31.65,82.2) v2(31.73,71.19) v2(31.9,51.7) v2(32.14,88.06) v2(32.34,52.46) v2(32.49,70.42) v2(32.65,87.3) v2(32.85,51.7) v2(33.09,88.06) v2(33.6,87.3) v2(33.77,90.66) v2(34.04,88.06) v2(34.28,89.9) v2(34.38,37.52) v2(34.72,90.66) v2(34.74,52.62) v2(34.89,36.76) v2(35.05,50.63) v2(35.18,53.38) v2(35.23,89.9) v2(35.4,41.7) v2(35.34,37.52) v2(35.56,49.86) v2(35.68,90.66) v2(35.69,52.62) v2(35.91,40.94) v2(35.85,36.76) v2(36,50.63) v2(36.14,53.38) v2(36.29,37.52) v2(36.36,41.7) v2(36.51,49.86) v2(36.87,40.94) v2(36.97,52.97) v2(36.95,50.63) v2(37.26,51.75) v2(37.31,41.7) v2(37.92,52.97) v2(38.21,51.75) v2(38.62,50.93) v2(38.87,52.97) v2(39.13,50.17) v2(40.57,97.63) v2(40.66,77.96) v2(41.01,80.72) v2(41.08,96.87) v2(41.17,77.2) v2(41.52,97.63) v2(41.52,79.95) v2(41.61,77.96) v2(41.63,90.46) v2(41.97,80.72) v2(42.03,96.87) v2(42.14,89.69) v2(42.48,97.63) v2(42.58,90.46) v2(43.09,89.69) v2(43.53,90.46) v2(46.83,10.95) v2(47.34,10.18) v2(47.78,10.95) v2(47.85,9.11) v2(48.31,12.58) v2(48.36,8.35) v2(48.82,11.82) v2(48.8,9.11) v2(49.26,12.58) v2(49.58,10.69) v2(50.09,9.93) v2(50.53,10.69) v2(50.7,13.75) v2(51.21,12.99) v2(51.66,13.75) v2(53.66,33.13) v2(54.1,33.9) v2(57.83,28.09) v2(59.17,27.78) v2(59.39,32.42) v2(59.63,3.52) v2(59.63,2.56) v2(59.63,1.61) v2(60.48,62.85) v2(60.55,1.36) v2(60.85,24.11) v2(60.99,62.09) v2(61.32,27.33) v2(61.32,26.38) v2(61.32,25.43) v2(61.42,20.24) v2(61.43,62.85) v2(61.52,31.2) v2(61.42,30.13) v2(61.42,29.18) v2(61.42,28.23) v2(61.5,1.36) v2(61.57,21.91) v2(61.7,16.99) v2(61.69,16.12) v2(61.81,24.11) v2(61.72,17.78) v2(61.94,62.09) v2(61.98,22.99) v2(62.03,21.15) v2(62.15,25.7) v2(62.28,34.66) v2(62.38,62.85) v2(62.33,32.27) v2(62.37,20.24) v2(62.47,31.2) v2(62.52,21.91) v2(62.45,1.36) v2(62.67,17.78) v2(62.66,16.99) v2(62.64,16.12) v2(62.76,24.11) v2(62.89,62.09) v2(62.93,22.99) v2(62.98,21.15) v2(63.11,25.7) v2(63.34,62.85) v2(63.39,35.48) v2(63.32,20.24) v2(63.4,1.36) v2(63.42,31.2) v2(63.47,21.91) v2(63.61,24.73) v2(63.61,16.99) v2(63.59,16.12) v2(63.62,17.78) v2(63.85,62.09) v2(63.88,22.99) v2(63.94,21.15) v2(64.06,25.7) v2(64.57,24.73) v2(64.75,31.45) v2(65.34,1.41) v2(65.52,24.73) v2(65.89,31.4) v2(66,2.64) v2(66.29,1.41) v2(66.82,7.38) v2(66.96,2.64) v2(67.25,1.41) v2(67.91,2.64) v2(68.04,34.31) v2(68.2,1.41) v2(68.37,7.53) v2(68.64,34.92) v2(68.86,2.64) v2(68.97,43.02) v2(68.97,42.07) v2(68.97,41.12) v2(68.97,40.16) v2(69.03,34) v2(69.3,36.14) v2(69.58,42.46) v2(69.58,41.51) v2(69.58,40.56) v2(69.59,34.92) v2(70.14,5.14) v2(70.25,36.14) v2(70.22,16.7) v2(70.27,7.18) v2(70.39,10.44) v2(70.54,34.92) v2(70.79,19.35) v2(70.89,17.92) v2(71.21,36.14) v2(71.18,16.7) v2(71.51,34.97) v2(71.45,20.57) v2(71.74,19.35) v2(71.84,17.92) v2(71.92,10.54) v2(72.07,96.81) v2(72.13,16.7) v2(72.4,20.57) v2(72.58,11.77) v2(72.69,19.35) v2(72.79,17.92) v2(72.86,97.91) v2(72.87,10.54) v2(73.23,96.81) v2(73.35,20.57) v2(73.43,13.19) v2(73.54,11.77) v2(73.64,19.35) v2(73.82,10.54) v2(74.07,97.91) v2(74.3,20.57) v2(74.38,96.81) v2(74.39,13.19) v2(74.49,11.77) v2(74.78,10.54) v2(75.03,61.7) v2(75.05,14.42) v2(75.24,35.53) v2(75.34,13.19) v2(75.44,11.77) v2(75.53,96.81) v2(75.54,60.93) v2(75.75,34.77) v2(75.98,61.7) v2(76,14.42) v2(76.19,35.53) v2(76.49,60.93) v2(76.55,15.88) v2(76.68,96.81) v2(76.7,34.77) v2(76.85,98.01) v2(76.93,93.8) v2(76.94,61.7) v2(77.14,35.53) v2(77.31,15.08) v2(77.45,60.93) v2(77.53,95.59) v2(77.57,17.21) v2(77.65,34.77) v2(77.84,96.81) v2(77.89,61.7) v2(78.08,93.8) v2(78.09,35.53) v2(78.04,27.33) v2(78.18,28.44) v2(78.28,26.05) v2(78.4,60.93) v2(78.6,34.77) v2(78.68,95.59) v2(78.99,96.81) v2(78.99,27.33) v2(79.04,25.28) v2(79.13,28.44) v2(79.23,93.8) v2(79.23,26.05) v2(79.84,95.59) v2(79.94,27.33) v2(80,25.28) v2(80.08,28.44) v2(80.14,96.81) v2(80.18,26.05) v2(80.38,93.8) v2(80.99,95.59) v2(80.95,25.28) v2(81.54,93.8) v2(81.65,26.61) v2(82.14,95.59) v2(82.38,96.81) v2(82.49,29.46) v2(82.5,27.16) v2(82.69,93.8) v2(83.21,28.34) v2(83.29,95.59) v2(83.44,29.46) v2(83.53,96.81) v2(83.84,93.8) v2(84.16,28.34) v2(84.44,95.59) v2(84.68,96.81) v2(84.99,93.8) v2(85.6,95.59) v2(85.83,96.81) v2(86.01,61.55) v2(86.52,60.79) v2(86.75,25.99) v2(86.8,24.82) v2(86.91,75.92) v2(86.98,96.81) v2(86.97,61.55) v2(87.43,75.16) v2(87.48,60.79) v2(87.54,26.61) v2(87.54,25.43) v2(87.88,85.1) v2(87.87,75.92) v2(87.88,72.86) v2(87.92,61.55) v2(88.39,84.34) v2(88.38,75.16) v2(88.39,72.1) v2(88.4,36.25) v2(88.4,35.3) v2(88.39,25.79) v2(88.43,60.79) v2(88.61,37.16) v2(88.82,75.92) v2(88.84,85.1) v2(88.84,72.86) v2(88.87,61.55) v2(89.09,20.21) v2(89.35,84.34) v2(89.33,75.16) v2(89.35,72.1) v2(89.38,60.79) v2(89.57,37.78) v2(89.79,85.1) v2(89.77,75.92) v2(89.79,72.86) v2(90.3,84.34) v2(90.28,75.16) v2(90.3,72.1) v2(90.74,85.1) v2(90.74,72.86) v2(90.72,37.93) v2(91.25,84.34) v2(91.25,72.1) v2(91.83,37.98) v2(92.03,37.11) v2(96.94,20.05) v2(97.51,38.03) v2(98.46,38.03) v2(99.02,54.71) v2(99.07,61.29) v2(99.41,38.03) v2(99.67,8.25) v2(99.73,60.57) v2(99.89,54.3) v2(100.04,61.34) v2(100.23,10.9) v2(100.33,9.47) v2(100.58,98.85) v2(100.62,8.25) v2(100.89,12.12) v2(101.11,61.19) v2(101.18,10.9) v2(101.23,32.39) v2(101.28,9.47) v2(101.57,8.25) v2(101.74,98.85) v2(101.84,21.84) v2(101.84,12.12) v2(101.93,60.73) v2(102.13,10.9) v2(102.23,9.47) v2(102.48,58.46) v2(102.48,57.51) v2(102.48,56.56) v2(102.48,55.61) v2(102.52,8.25) v2(102.63,64.19) v2(102.63,63.23) v2(102.63,62.28) v2(102.79,12.12) v2(102.86,65.2) v2(102.88,60.73) v2(103.08,10.9) v2(103.18,9.47) v2(103.34,2.28) v2(103.52,32.5) v2(103.66,65.88) v2(103.7,57.8) v2(103.7,56.85) v2(103.7,55.89) v2(103.7,54.94) v2(103.75,12.12) v2(103.85,63.52) v2(103.85,62.57) v2(103.85,61.62) v2(103.85,60.67) v2(103.9,4.93) v2(104,3.5) v2(104.19,25.25) v2(104.29,36.88) v2(104.29,2.28) v2(104.56,6.16) v2(104.85,4.93) v2(104.95,3.5) v2(105.24,2.28) v2(105.39,57.77) v2(105.51,6.16) v2(105.8,4.93) v2(105.9,3.5) v2(106.19,2.28) v2(106.43,60.78) v2(106.47,6.16) v2(106.7,8.14) v2(106.75,4.93) v2(106.86,3.5) v2(107.01,35.85) v2(107.26,10.8) v2(107.4,60.79) v2(107.37,9.37) v2(107.42,6.16) v2(107.66,8.14) v2(107.93,12.02) v2(108.09,41.29) v2(108.09,40.33) v2(108.09,39.38) v2(108.11,38.06) v2(108.22,10.8) v2(108.32,9.37) v2(108.42,54.19) v2(108.6,32.57) v2(108.61,8.14) v2(108.73,55.32) v2(108.88,12.02) v2(108.96,60.61) v2(108.94,59.54) v2(109.01,53.7) v2(109.17,10.8) v2(109.27,9.37) v2(109.56,8.14) v2(109.63,57.35) v2(109.75,23.62) v2(109.83,62.61) v2(109.83,12.02) v2(109.97,53.7) v2(110.12,10.8) v2(110.24,64.81) v2(110.22,9.37) v2(110.36,24.13) v2(110.43,6.05) v2(110.77,28.11) v2(110.78,12.02) v2(110.87,26.58) v2(110.99,8.71) v2(111.09,7.28) v2(111.38,62.3) v2(111.4,60) v2(111.41,58.01) v2(111.38,6.05) v2(111.43,61.07) v2(111.45,58.83) v2(111.66,11.43) v2(111.65,9.93) v2(111.94,8.71) v2(112.04,7.28) v2(112.33,6.05) v2(112.6,9.93) v2(112.65,11.54) v2(112.89,8.71) v2(112.99,7.28) v2(113.03,60.27) v2(113.18,61.12) v2(113.21,22.4) v2(113.28,6.05) v2(113.55,9.93) v2(113.65,43.58) v2(113.65,42.63) v2(113.65,41.68) v2(113.84,8.71) v2(113.95,7.28) v2(114.03,30.1) v2(114.1,11.64) v2(114.51,9.93) v2(115,61.12) v2(115.69,22.3) v2(115.95,24.9) v2(116.28,23.83) v2(116.73,26.27) v2(116.84,22.3) v2(117.01,57.21) v2(117.04,60.47) v2(117.21,59.55) v2(117.16,54.81) v2(117.57,52.16) v2(117.67,58.43) v2(117.87,60.78) v2(117.82,56.03) v2(117.96,57.21) v2(118.11,54.81) v2(118.16,59.55) v2(118.23,53.38) v2(118.28,36.83) v2(118.4,83.68) v2(118.4,37.97) v2(118.52,52.16) v2(118.62,58.43) v2(118.77,56.03) v2(118.82,60.78) v2(118.91,57.21) v2(119.11,59.55) v2(119.06,54.81) v2(119.18,53.38) v2(119.47,52.16) v2(119.57,58.43) v2(119.78,60.78) v2(119.73,56.03) v2(119.88,82.61) v2(119.86,57.21) v2(119.84,50.68) v2(119.98,83.47) v2(120.01,54.81) v2(120.07,59.55) v2(120.13,53.38) v2(120.42,52.16) v2(120.52,58.43) v2(120.68,56.03) v2(120.68,38.11) v2(120.73,60.78) v2(120.8,50.68) v2(120.76,36.63) v2(121.09,53.38) v2(121.49,55.04) v2(121.75,50.68) v2(122.09,59.15) v2(122.11,56.95) v2(122.24,52.26) v2(122.36,53.41) v2(122.34,8.32) v2(122.58,82.71) v2(122.7,60.22) v2(122.77,58.18) v2(122.88,83.47) v2(123.09,84.19) v2(123.04,59.15) v2(123.06,56.95) v2(123.07,54.76) v2(123.14,85.71) v2(123.19,52.26) v2(123.49,8.32) v2(123.65,60.22) v2(123.72,58.18) v2(123.64,53.31) v2(123.74,55.98) v2(123.99,59.15) v2(124.01,56.95) v2(124.03,54.76) v2(124.13,85.71) v2(124.15,52.26) v2(124.3,10.41) v2(124.35,21.63) v2(124.49,22.4) v2(124.6,60.22) v2(124.67,58.18) v2(124.69,55.98) v2(124.64,9.24) v2(124.96,56.95) v2(124.98,54.76) v2(125.14,29.13) v2(125.49,23.88) v2(125.5,21.63) v2(125.51,10.87) v2(125.62,58.18) v2(125.64,55.98) v2(125.76,59.5) v2(125.88,48.31) v2(125.93,54.76) v2(126.18,29.18) v2(126.24,60.6) v2(126.36,88.78) v2(126.34,49.28) v2(126.37,20.46) v2(126.59,55.98) v2(126.59,9.75) v2(126.71,59.5) v2(126.65,21.63) v2(126.76,78.32) v2(126.95,29.85) v2(127,19.65) v2(127.31,58.25) v2(127.26,57.18) v2(127.26,48.49) v2(127.36,60.6) v2(127.42,30.71) v2(127.38,10.16) v2(127.51,88.78) v2(127.57,56.11) v2(127.57,41.42) v2(127.66,59.5) v2(127.92,78.32) v2(127.92,49.71) v2(128.06,39.23) v2(128.21,48.49) v2(128.21,29.64) v2(128.57,30.71) v2(128.66,88.78) v2(128.84,51.09) v2(128.87,49.71) v2(128.99,10.31) v2(129.07,78.32) v2(129.16,48.49) v2(129.5,52.31) v2(129.47,11.79) v2(129.66,79.54) v2(129.81,88.78) v2(129.79,51.09) v2(129.72,30.71) v2(129.82,49.71) v2(130.11,48.49) v2(130.14,10.31) v2(130.22,78.32) v2(130.45,52.31) v2(130.71,76.94) v2(130.74,51.09) v2(130.78,49.71) v2(130.88,53.66) v2(130.97,88.78) v2(130.98,20.46) v2(131.03,41.73) v2(131.3,79.39) v2(131.29,48.67) v2(131.29,10.31) v2(131.37,78.32) v2(131.4,52.31) v2(131.56,67.92) v2(131.69,51.09) v2(131.73,64.91) v2(131.75,43.67) v2(131.9,47.85) v2(131.95,54.84) v2(132.01,49.98) v2(131.95,42.29) v2(132.11,60.96) v2(132.11,59.68) v2(132.11,58.41) v2(132.05,57.13) v2(132.2,87.86) v2(132.16,55.96) v2(132.13,20.46) v2(132.29,76.99) v2(132.31,53.61) v2(132.36,52.31) v2(132.51,67.92) v2(132.46,48.87) v2(132.45,10.31) v2(132.53,78.32) v2(132.68,64.91) v2(132.72,41.5) v2(132.87,43.87) v2(132.92,42.75) v2(133.15,87.19) v2(133.15,86.04) v2(133.15,84.89) v2(133.15,83.74) v2(133.15,82.59) v2(133.15,81.43) v2(133.15,80.28) v2(133.15,79.13) v2(133.21,75.84) v2(133.21,74.69) v2(133.21,73.54) v2(133.21,72.39) v2(133.21,71.23) v2(133.21,70.08) v2(133.21,68.93) v2(133.18,30.71) v2(133.27,66.44) v2(133.28,20.46) v2(133.36,67.87)
VIN_12V: length 12.9
  Top Layer w2: 68.58,25.82 68.58,18.04 67.09,16.55 D1.2
  vias: v2(67.29,15.56)
(no net):
  vias: v1(64.54,29.84) v1(64.54,29.22) v1(64.54,28.6) v1(64.54,27.98) v1(64.54,27.36) v1(65.17,29.84) v1(65.17,29.22) v1(65.17,28.6) v1(65.17,27.98) v1(65.17,27.36) v1(65.81,29.84) v1(65.81,29.22) v1(65.81,28.6) v1(65.81,27.98) v1(65.81,27.36) v1(66.45,29.84) v1(66.45,29.22) v1(66.45,28.6) v1(66.45,27.98) v1(66.45,27.36)
2_EN_O: length 153
  Top Layer w0.4: 100.99,62.82 69.03,62.82 v2(66.86,60.66) ; H7.8 15.44,45.92 23.21,45.92 33.25,55.96 v2(33.25,58.82)
  Bottom Layer w0.4: 34.27,59.79 34.22,59.84 34.22,75.04 32.79,76.47 16.16,76.47 H2.8 ; 34.27,59.79 33.3,58.82 16.89,58.82 H4.8 ; 34.27,59.79 66,59.79 v2(66.86,60.66)
A_1A: length 33.5
  Top Layer w0.6: R20.1 25.08,90.51 H3.4
  Bottom Layer w1: H3.4 24.31,90.26 17.96,83.91 14.14,83.91 5.28,75.05 P8.3
A_1B: length 36.7
  Top Layer w0.6: H3.3 26.85,87.03 R22.1
  Bottom Layer w1: P8.4 4.88,72.51 14.85,82.48 18.5,82.48 26.85,90.83 H3.3 ; 2.64,72.66 2.8,72.66
A_2A: length 30.2
  Top Layer w0.6: R19.1 23.17,89.87 H3.5
  Bottom Layer w1: P8.2 5.58,77.59 13.27,85.28 16.84,85.28 21.77,90.22 H3.5
A_2B: length 26.8
  Top Layer w0.6: R18.1 21.27,89.24 H3.6
  Bottom Layer w1: H3.6 19.23,90.28 15.61,86.66 12.4,86.66 5.87,80.13 P8.1
A_DIR_O: length 74.2
  Top Layer w0.4: H2.1 33.95,78.47 46.35,66.07 100.99,66.07
A_STEP_O: length 77.8
  Top Layer w0.4: 100.99,66.72 47.44,66.72 34.27,79.88 30.55,79.88 29.39,78.73 H2.2
B_1A: length 31.9
  Top Layer w0.6: 24.91,70.4 24.91,73.76 H5.4
  Bottom Layer w1: P10.3 7.45,61.87 12.25,66.67 18.42,66.67 24.31,72.56 H5.4
B_1B: length 35.5
  Top Layer w0.6: 26.78,70.4 26.85,70.48 H5.3
  Bottom Layer w1: H5.3 26.85,72.25 19.24,64.63 13.93,64.63 8.63,59.33 P10.4
B_2A: length 27.6
  Top Layer w0.6: H5.5 23.04,73.09 23.04,70.4
  Bottom Layer w1: P10.2 6.16,64.41 10.36,68.61 16.03,68.61 H5.5
B_2B: length 24.3
  Top Layer w0.6: H5.6 21.17,72.42 21.17,70.4
  Bottom Layer w1: H5.6 15.07,70.19 8.88,70.19 5.64,66.95 P10.1
B_DIR_O: length 70.4
  Top Layer w0.4: H4.1 57.51,61.55 60.73,64.77 100.99,64.77
B_STEP_O: length 73.2
  Top Layer w0.4: H4.2 31.1,63.26 56.92,63.26 59.08,65.42 100.99,65.42
C_1A: length 30.9
  Top Layer w0.6: R38.1 24.94,56.97 H8.4
  Bottom Layer w1: P14.3 13.59,48.68 17.5,52.59 22.4,52.59 24.31,54.51 H8.4
C_1B: length 34.2
  Top Layer w0.6: H8.3 26.92,57.52 R39.1
  Bottom Layer w1: P14.4 13.09,46.14 18.11,51.16 23.11,51.16 26.85,54.91 H8.3 ; 2.78,46.27 2.88,46.17
C_2A: length 26.9
  Top Layer w0.6: H8.5 22.95,56.42 R37.1
  Bottom Layer w1: P14.2 13.48,51.22 16.28,54.02 20.15,54.02 21.77,55.64 H8.5
C_2B: length 23.1
  Top Layer w0.6: H8.6 20.96,55.86 R36.1
  Bottom Layer w1: P14.1 13.57,53.76 15.31,55.5 18.37,55.5 19.23,56.36 H8.6
C_DIR_O: length 76.9
  Top Layer w0.4: 100.99,63.47 68.15,63.47 49.31,44.64 H7.1
C_STEP_O: length 79.7
  Top Layer w0.4: H7.2 31.49,46.73 50.18,46.73 67.57,64.12 100.99,64.12
ESP_BOOT: length 34.6
  Top Layer w0.4: U9.25 115.43,41.45 113.21,39.23 113.21,37.95 111.12,35.86 111.12,34.03 v2(109.75,32.65) ; Q1.3 99.09,29.59 v2(100.16,29.59) ; K2.2 111.37,30.05 v2(108.16,30.05)
  Bottom Layer w0.4: v2(100.16,29.59) 107.71,29.59 v2(108.16,30.05) 108.16,31.07 v2(109.75,32.65)
ESP_RST: length 60.7
  Top Layer w0.4: v2(124.43,50.55) 129.4,55.52 U9.3 ; v2(114.74,25.71) 117.14,28.11 117.14,32.9 118.77,34.54 121.07,34.54 v2(122.5,35.96) ; R35.2 104.83,27.73 Q2.3 106.03,27.19 106.58,26.63 106.58,25.47 R28.1 108.75,25.39 C23.2 108.82,25.46 v2(110.26,25.46)
  Bottom Layer w0.4: v2(110.26,25.46) 114.49,25.46 v2(114.74,25.71) ; v2(122.5,35.96) 125.5,38.97 125.5,46.52 124.43,47.59 v2(124.43,50.55)
I2S_BCK: length 24.9
  Top Layer w0.4: U9.12 117.97,64.67 117.44,65.2 114.18,65.2 112.45,63.47 110.49,63.47 ; 110.49,63.47 110.56,63.41 R16.1 109.61,56.41 109.6,56.42 106.64,56.42 ; 110.49,63.47 106.72,63.47
I2S_DATA: length 17
  Top Layer w0.4: 106.72,65.42 112.47,65.42 113.57,66.52 119.02,66.52 120.51,65.03 U9.10
I2S_MR#: length 16.7
  Top Layer w0.4: 106.72,62.82 v2(105.31,62.82) ; 106.64,55.77 105.32,55.77 v2(105.31,55.75) 105.31,54.63 106.62,53.31 C17.2 106.59,51.89 R24.1
  Bottom Layer w0.4: v2(105.31,55.75) 104.61,56.45 104.61,62.12 v2(105.31,62.82)
I2S_WS: length 25.5
  Top Layer w0.4: U9.11 119.24,65.03 118.46,65.81 113.92,65.81 112.24,64.12 106.72,64.12 ; 106.64,57.07 108.21,57.07 109.69,58.56 109.69,61.52 v2(108.57,62.64)
  Bottom Layer w0.4: v2(108.57,62.64) 108.11,63.1 v2(108.11,64.12)
I2SO(0): length 39.4
  Top Layer w0.4: 106.72,66.07 107.98,66.07 108.45,66.55 108.45,67.31 105.72,70.04 102.46,70.04 94.25,78.25 H1.1
I2SO(8): length 18.8
  Top Layer w0.4: v2(105.36,58.92) 105.46,59.02 U8.15
  Bottom Layer w0.4: v2(105.36,58.92) 106.4,58.92 107.5,57.81 107.5,55.04 106.03,53.57 96.73,53.57 H9.4
IO2: length 38.7
  Top Layer w0.4: v2(110.26,49.01) 110.56,48.71 U9.24 ; U7.2 78.89,51.31 v2(79.09,51.11)
  Bottom Layer w0.4: v2(79.09,51.11) 79.44,50.76 103.06,50.76 104.8,49.01 v2(110.26,49.01)
IO2_OUT: length 53
  Top Layer w0.4: U7.4 69.69,52.26 42.02,24.59 P11.2
IO4: length 31
  Top Layer w0.4: R21.1 118.44,20.89 v2(119.33,21.79) ; U9.26 v2(116.7,42.95)
  Bottom Layer w0.4: v2(119.33,21.79) 119.33,34.18 116.7,36.81 v2(116.7,42.95)
IO4_OUT: length 15.3
  Top Layer w0.4: R17.2 124.61,16.34 R21.2 120.1,16.4 R23.1
  Top Layer w0.6: R17.2 124.75,14.55 D8.2 124.8,14.39 P9.2
IO12: length 46.9
  Top Layer w0.4: v2(82.47,77.95) U12.2 ; U9.14 v2(113.99,62.92)
  Bottom Layer w0.4: v2(82.47,77.95) 82.47,72.74 86.04,69.17 105.01,69.17 107.05,67.13 111.03,67.13 113.99,64.18 v2(113.99,62.92)
IO14: length 7.9
  Top Layer w0.4: U9.13 116.69,62.94 116.69,64.38 v2(116.59,64.48) ; R42.1 v2(112.86,67.44)
  Bottom Layer w0.4: v2(116.59,64.48) 115.82,64.48 v2(112.86,67.44)
IO14_IN: length 12.1
  Top Layer w0.6: R42.2 109.91,67.46 109.91,69.12 110.42,69.63 P17.1 107.88,71.52 R40.2 105.67,71.86 105.47,71.66
IO15: length 68.8
  Top Layer w0.4: v2(79.82,36.99) 60.18,36.99 55.54,32.36 U5.4 ; U9.23 112.59,49.98 v2(112.55,49.94) ; v2(82.21,36.99) 84.1,36.99 84.87,36.23 86.07,36.23 R15.2 86.28,36.21 89.1,39.03 v2(96.09,39.03) 98.07,41.02 98.07,42.3 100.22,44.44 107.05,44.44 v2(109.19,46.58)
  Bottom Layer w0.4: v2(112.55,49.94) v2(109.19,46.58) ; v2(79.82,36.99) v2(82.21,36.99)
IO22: length 24.4
  Top Layer w0.4: v2(123.72,29.13) 123.21,28.62 R13.1 120.69,26.74 U4.2 ; v2(129.02,38.97) 129.4,39.35 U9.36
  Bottom Layer w0.4: v2(129.02,38.97) 123.72,33.67 v2(123.72,29.13)
IO32: length 7.6
  Top Layer w0.4: R29.1 124.18,70.05 123.05,68.92 U9.8
IO32_IN: length 12.1
  Top Layer w0.4: R26.2 124.13,71.75 R29.2 126.12,71.65 C19.2 126.27,73.1 D9.2
  Top Layer w0.6: D9.2 127.08,73.25 128.81,71.52 P12.1
IO33: length 10.7
  Top Layer w0.4: U9.9 121.78,65.87 118.82,68.83 115.26,68.83
IO33_IN: length 11.5
  Top Layer w0.6: D13.2 115.15,74.65 R41.2 ; D13.2 115.67,70.48 R43.2 ; D13.2 116.02,74.12 118.63,71.52 P18.1
M_EN_O: length 90.7
  Top Layer w0.4: U8.1 65.47,59.67 39.37,33.57 P2.2 P2.4 P2.6
PROBE: length 20.7
  Top Layer w0.4: U9.7 124.32,65.2 v2(123.87,65.65) ; U10.4 119.87,80.21 120.57,79.5 R34.2 120.57,76.73 v2(120.56,76.71)
  Bottom Layer w0.4: v2(120.56,76.71) 121.78,75.49 121.78,67.74 v2(123.87,65.65)
PROBE_O: length 8.8
  Top Layer w0.6: U10.2 124.75,84.22 D10.2 125.65,84.87 127,83.52 P13.2
PWM: length 74.9
  Top Layer w0.3: 112.96,58.87 112.38,58.87 112.35,58.83
  Top Layer w0.4: U13.2 101.33,46.83 102.04,47.54 104.34,47.54 106.53,49.74 109.44,49.74 112.35,52.64 v2(112.35,62.59) ; U14.2 74.87,78 v2(75.63,77.23) ; U9.16 112.96,58.87
  Bottom Layer w0.4: v2(112.35,62.59) 112.35,65 110.82,66.52 106.44,66.52 104.55,68.41 84.46,68.41 v2(75.63,77.23)
PWM_5V: length 25.4
  Top Layer w0.4: P20.1 56.86,95.67 65.15,87.38 74.72,87.38 75.82,86.28 U14.4
PWM_LAS: length 64.5
  Top Layer w0.4: v2(99.37,41.8) 100.38,42.82 U13.4
  Bottom Layer w0.4: P21.2 53.7,3.13 61.86,11.29 69.67,11.29 99.37,40.99 v2(99.37,41.8)
R1IN: length 44.4
  Top Layer w0.6: U11.13 66.96,74.32 v2(66.99,74.35)
  Bottom Layer w0.6: v2(66.99,74.35) 47.12,94.21 36.52,94.21 34.64,96.09 P15.2
R1OUT: length 4.4
  Top Layer w0.4: U11.12 67.61,73.05 68.99,74.43 D11.1
R2IN: length 34.6
  Top Layer w0.4: 39.47,86.51 41.46,86.51 44.37,83.6 44.37,73.05 49.32,68.1 57.53,68.1 58.66,69.24 U11.8
R2OUT: length 4.7
  Top Layer w0.4: R48.1 68.68,68.41 67.85,69.24 U11.9
RGB_OUT: length 12.8
  Top Layer w0.6: U4.4 119.66,24.41 120.51,25.25 131.34,25.25 131.5,25.1
RX2: length 5.8
  Top Layer w0.4: P22.2 131.37,35.41 125.75,35.41
RXD: length 108.2
  Top Layer w0.3: v2(83.07,53.1) 83.33,52.85 v2(83.33,49.74)
  Top Layer w0.4: v2(96.28,31.02) 96.94,31.68 105.24,31.68 ; 105.24,31.68 105.16,31.77 R51.1 107.18,33.02 D14.1 ; 105.24,31.68 113.37,31.68 114.95,33.26 114.95,37.95 118.06,41.07 124.43,41.07 126.86,43.49 U9.34 ; v2(86.85,30.71) 88.9,30.71 H6.2 90.83,26.85 D17.2 ; D11.2 73.44,74.53 v2(73.7,74.27)
  Bottom Layer w0.4: v2(83.07,53.1) 83.07,53.31 80.32,56.06 80.32,65.61 74.77,71.16 74.77,73.2 v2(73.7,74.27) ; v2(86.85,30.71) 86.85,31.95 83.73,35.07 83.73,49.34 v2(83.33,49.74) ; H6.2 93.06,31.02 v2(96.28,31.02)
RXD2: length 84.5
  Top Layer w0.4: R48.2 72.37,68.41 v2(72.88,67.9) ; v2(122.55,37.81) 122.55,37.01 R58.1 ; v2(118.01,44.23) 118.01,45.89 U9.27 ; 88.69,54.03 v2(88.69,51.58)
  Bottom Layer w0.4: v2(122.55,37.81) 122.55,39.59 124.24,41.28 124.24,43.16 123.17,44.23 v2(118.01,44.23) 118.01,49.33 115.76,51.58 v2(88.69,51.58) 81.05,51.58 72.88,59.75 v2(72.88,67.9)
SD_CD: length 54.9
  Top Layer w0.4: R60.1 99.95,18.63 v2(99.95,17.4) 99.25,16.69 U16.9 ; v2(123.16,41.73) 123.92,41.73 125.59,43.4 U9.33
  Bottom Layer w0.4: v2(123.16,41.73) 121.68,40.25 121.68,20.51 118.57,17.4 v2(99.95,17.4)
SD_CS: length 37.8
  Top Layer w0.4: v2(120.05,42.75) 120.51,43.21 U9.29 ; v2(108.47,18.83) 108.31,18.67 R54.1 107.41,17.79 106.95,17.32 U16.2 ; v2(118.62,39.69) 116.53,37.6 116.53,29.18 109.8,22.45 v2(109.24,22.45)
  Bottom Layer w0.4: v2(108.47,18.83) 108.47,21.69 v2(109.24,22.45) ; v2(118.62,39.69) 118.62,41.32 v2(120.05,42.75)
SD_MISO: length 43.4
  Top Layer w0.4: v2(113.11,32.65) 114.39,33.92 114.39,38.41 117.7,41.73 122.09,41.73 123.05,42.69 U9.31 ; v2(102.91,18.68) 101.91,18.68 R57.1 101.91,17.79 101.45,17.33 U16.7
  Bottom Layer w0.4: v2(102.91,18.68) 102.91,22.45 v2(113.11,32.65)
SD_MOSI: length 51.5
  Top Layer w0.4: U16.3 105.85,16.61 v2(105.82,16.64) 105.4,17.06 R55.1 ; U9.37 130.67,42.97 v2(130.4,42.7)
  Bottom Layer w0.4: v2(130.4,42.7) 122.85,35.15 122.85,20.51 118.98,16.64 v2(105.82,16.64)
SD_SCLK: length 40.6
  Top Layer w0.4: U16.5 103.65,20.23 105.26,21.84 v2(105.26,25.76) ; v2(118.11,42.8) 117.99,42.8 113.83,38.63 113.83,34.28 v2(112.12,32.57) ; v2(121.48,43.41) 121.78,43.72 U9.30
  Bottom Layer w0.4: v2(118.11,42.8) 118.72,43.41 v2(121.48,43.41) ; v2(112.12,32.57) 105.31,25.76 v2(105.26,25.76)
SW3_OUT: length 26.7
  Top Layer w0.4: U12.4 83.42,84.95 75.99,92.38 65.28,92.38 63.47,94.19 P19.3
T1IN: length 14.2
  Top Layer w0.4: U11.11 68.18,71.78 D12.2 ; R49.2 65.19,79.82 v2(65.89,79.12)
  Bottom Layer w0.4: v2(65.89,79.12) 67.98,77.03 v2(67.98,71.77)
T1OUT: length 42.3
  Top Layer w0.6: U11.14 63.76,75.59 v2(63.5,75.85)
  Bottom Layer w0.6: v2(63.5,75.85) 46.36,92.99 36.24,92.99 32.1,97.13 32.1,97.38
T2IN: length 4.3
  Top Layer w0.4: U11.10 69.52,70.51 R46.1
T2OUT: length 40.3
  Top Layer w0.4: 39.47,83.97 41.71,83.97 43.55,82.13 43.55,72.18 48.3,67.44 61.61,67.44 62.27,68.1 62.27,69.99 61.75,70.51 U11.7
TX2: length 5.8
  Top Layer w0.4: R56.2 131.46,37.86 P22.3
TXD: length 104.1
  Top Layer w0.3: v2(81.8,53) 81.8,49.89 v2(82.05,49.63)
  Top Layer w0.4: v2(86.13,31.43) 90.72,31.43 H6.1 93.37,27.35 D16.1 ; v2(73.8,72.23) 73.49,72.54 D12.1 ; U9.35 128.13,43.69 124.84,40.4 118.26,40.4 115.71,37.85 115.71,33.16 113.62,31.07 98.02,31.07 v2(97.1,30.15)
  Bottom Layer w0.4: v2(97.1,30.15) 94.73,30.15 H6.1 ; v2(73.8,72.23) 73.8,70.35 79.5,64.64 79.5,55.29 v2(81.8,53) ; v2(86.13,31.43) 82.98,34.58 82.98,48.71 v2(82.05,49.63)
TXD2: length 82.5
  Top Layer w0.4: v2(123.37,38.83) 123.37,38.59 R56.1 ; R46.2 72.37,70.45 v2(72.62,70.19) ; U9.28 119.24,48.14 v2(119.23,48.15)
  Bottom Layer w0.4: v2(123.37,38.83) 124.9,40.36 124.9,45.82 122.56,48.15 v2(119.23,48.15) 119.23,48.88 115.99,52.13 115.26,52.13 115.01,52.37 91.23,52.37 ; v2(72.62,70.19) 74,68.82 74,59.57 81.2,52.37 91.23,52.37 ; 91.23,52.38 91.23,54.03
USB_DM: length 12.4
  Top Layer w0.3: U17.3 80.18,15.59 77.64,13.06 77.64,8.21 P23.2
USB_DP: length 17.2
  Top Layer w0.3: U17.1 81.36,17.49 77.1,13.24 77.1,6.92 78.33,5.69 P23.3
VUSB: length 25.1
  Top Layer w0.5: P23.1 80.83,10.21 84.4,13.78 84.4,16.02 84.92,16.54 U17.5 ; v2(78.99,18.78) 78.98,18.79 D15.2
  Bottom Layer w0.5: v2(78.99,18.78) 80.78,16.99 80.78,7.57 P23.1
X_DIR_O: length 89.3
  Top Layer w0.4: U8.3 66.51,58.37 31.55,23.41 P2.10
X_LIMT: length 33.2
  Top Layer w0.4: v2(108.98,79.88) 108.98,81.78 107.69,83.08 R2.2 ; U9.6 125.59,65.87 v2(124.28,67.18)
  Bottom Layer w0.4: v2(108.98,79.88) 109.75,79.11 119.28,79.11 122.55,75.85 122.55,68.91 v2(124.28,67.18)
X_LIMT_I: length 15.6
  Top Layer w0.4: R3.1 106.08,84.17 106.1,84.19 R1.1
  Top Layer w0.6: P1.4 P1.2 106.56,86.67 106.1,86.2 R1.1
X_STEP_O: length 88.5
  Top Layer w0.4: U8.2 65.99,59.02 32.92,25.95 P2.8
Y_DIR_O: length 90.8
  Top Layer w0.4: U8.5 67.71,57.07 28.97,18.33 P2.14
Y_LIMT: length 30
  Top Layer w0.4: v2(113.16,80.13) 113.16,81.86 111.92,83.1 ; U9.5 126.86,66.18 v2(125.4,67.64)
  Bottom Layer w0.4: v2(113.16,80.13) 119.44,80.13 123.21,76.36 123.21,69.83 v2(125.4,67.64)
Y_LIMT_I: length 15.8
  Top Layer w0.4: R7.1 110.31,82.08 110.33,82.1 R6.1 R5.1
  Top Layer w0.6: R5.1 110.33,92.7 P1.6 P1.8
Y_STEP_O: length 90.1
  Top Layer w0.4: P2.12 30.19,20.87 67.03,57.72 U8.4
Z_DIR_O: length 92.4
  Top Layer w0.4: U8.7 69.62,55.77 27.11,13.25 P2.18
Z_LIMT: length 26.1
  Top Layer w0.4: R11.2 116.16,82.85 v2(117.55,81.46) ; U9.4 128.13,66.18 v2(126.32,67.99)
  Bottom Layer w0.4: v2(126.32,67.99) 124.08,70.24 124.08,76.56 119.18,81.46 v2(117.55,81.46)
Z_LIMT_I: length 16
  Top Layer w0.4: R10.1 114.61,82.2 114.55,82.13 R12.1
  Top Layer w0.6: R10.1 114.61,89.49 116.56,91.44 P1.10 P1.12
Z_STEP_O: length 91.6
  Top Layer w0.4: U8.6 68.44,56.42 27.81,15.79 P2.16
$9N72390: length 9
  Top Layer w1: U2.2 70.12,27.86 71.79,26.19 L1.2 73.51,23.3 D2.2
$9N72392: length 4
  Top Layer w0.4: U2.4 68.41,32.07 67.8,32.67 R9.1
$9N72730: length 2.2
  Top Layer w0.4: R4.1 56.2,10.64 D3.1
$9N85928: length 7.9
  Top Layer w0.4: U15.4 88.61,15.43 87.99,16.06 87.99,21.89
$9N85949: length 6.2
  Top Layer w0.3: U15.5 88.74,14.16 87.36,15.55 87.36,17.15 87.01,17.49 U17.6
$9N85958: length 5.5
  Top Layer w0.3: U17.4 86.67,15.59 87.66,14.6 87.66,13.69 88.45,12.89 U15.6
$9N85962: length 11.7
  Top Layer w0.4: C36.1 94.84,6.19 Y1.2 95.13,7.84 91.35,11.62 U15.7
$9N85965: length 7.4
  Top Layer w0.4: C37.1 89.53,3.36 Y1.1 89.8,6.75 U15.8
$9N86544: length 7.1
  Top Layer w0.4: D17.1 91.44,22.65 91.44,18.38 91.04,17.97 U15.2
$9N86546: length 11.1
  Top Layer w0.4: U15.3 91.4,16.7 92.72,18.02 D16.2 93.76,23.31 R52.2
$9N86982: length 19.6
  Top Layer w0.4: v2(100.06,28.62) 99.61,28.17 Q1.2 ; R59.1 100.17,23.53 v2(100.87,24.23) ; U15.13 96.4,15.43 98.77,17.8 98.77,21.01 v2(99.09,21.33)
  Bottom Layer w0.4: v2(100.06,28.62) 100.87,27.8 v2(100.87,24.23) 100.87,23.11 v2(99.09,21.33)
$9N86987: length 16.3
  Top Layer w0.4: Q2.2 102.3,23.77 100.57,22.04 98.22,22.04 ; 98.22,22.04 97.61,22.65 97.61,23.45 R53.1 ; 98.22,22.04 98.02,21.84 98.02,18.32 96.4,16.7 U15.14
$9N89334: length 2
  Top Layer w0.4: 97.69,25.13 97.71,25.15 Q1.1
$9N89338: length 4.4
  Top Layer w0.4: 99.68,25.13 100.87,26.33 100.87,27.19 101.82,28.14 Q2.1
$9N98710: length 26.7
  Top Layer w0.4: v2(109.24,21.17) 109.24,21.22 R28.2 ; K1.3 117.36,11.93 C20.2 117.36,15.26 113.82,18.79 112.67,18.79 v2(112.65,18.78)
  Top Layer w0.6: 116.79,2.96 116.79,11.36
  Bottom Layer w0.4: v2(109.24,21.17) 111.63,18.78 v2(112.65,18.78)
$9N100955: length 2.2
  Top Layer w0.4: D5.1 81.46,22.93 R8.1
$9N120731: length 6.3
  Top Layer w0.4: 106.64,58.37 107.62,58.37 108.22,58.97 108.22,61.77 107.82,62.17 106.72,62.17
$9N144999: length 7.4
  Top Layer w0.4: U10.1 123.03,80.21 121.27,81.97 R33.2
$9N145132: length 3.3
  Top Layer w0.4: C28.1 57.93,71.78 U11.6
$9N145210: length 2.9
  Top Layer w0.4: C24.2 56.92,76.86 U11.2
$9N145285: length 2.9
  Top Layer w0.4: U11.4 57.09,74.32 C27.2
$9N145289: length 2.9
  Top Layer w0.4: U11.5 57.03,73.05 56.92,72.94
$9N145296: length 3.5
  Top Layer w0.4: 61.29,80.6 61.29,78.95 60.48,78.13 U11.1
$9N145300: length 7.1
  Top Layer w0.4: C25.1 62.84,77.19 61.24,75.59 U11.3
$9N177844: length 2.5
  Top Layer w0.6: H2.4 H2.3
$9N190158: length 2.5
  Top Layer w0.6: H4.4 H4.3
$9N190589: length 2.5
  Top Layer w0.6: H7.4 H7.3
$9N210537: length 3.6
  Top Layer w0.4: R14.2 55.54,21.17 55.54,24.71
$9N249958: length 2
  Top Layer w0.4: C3.1 107.67,79.11 R3.2
$9N250248: length 2
  Top Layer w0.4: C5.1 111.96,81.11 R7.2
$9N250310: length 1.8
  Top Layer w0.4: 116.14,79.46 116.14,81.22 R12.2
$9N250420: length 2.2
  Top Layer w0.6: C30.2 103.42,72.12 103.88,71.66
$9N250460: length 2.2
  Top Layer w0.6: 113.88,72.47 113.88,70.54 C31.2
$9N250602: length 1.9
  Top Layer w0.4: R23.2 121.74,18.34 C14.2

## Copper pours and planes (outline as drawn; the poured copper is in the pictures)
